# EAGLE design LickStick v1_0_1 (EAGLE 9.6.2)
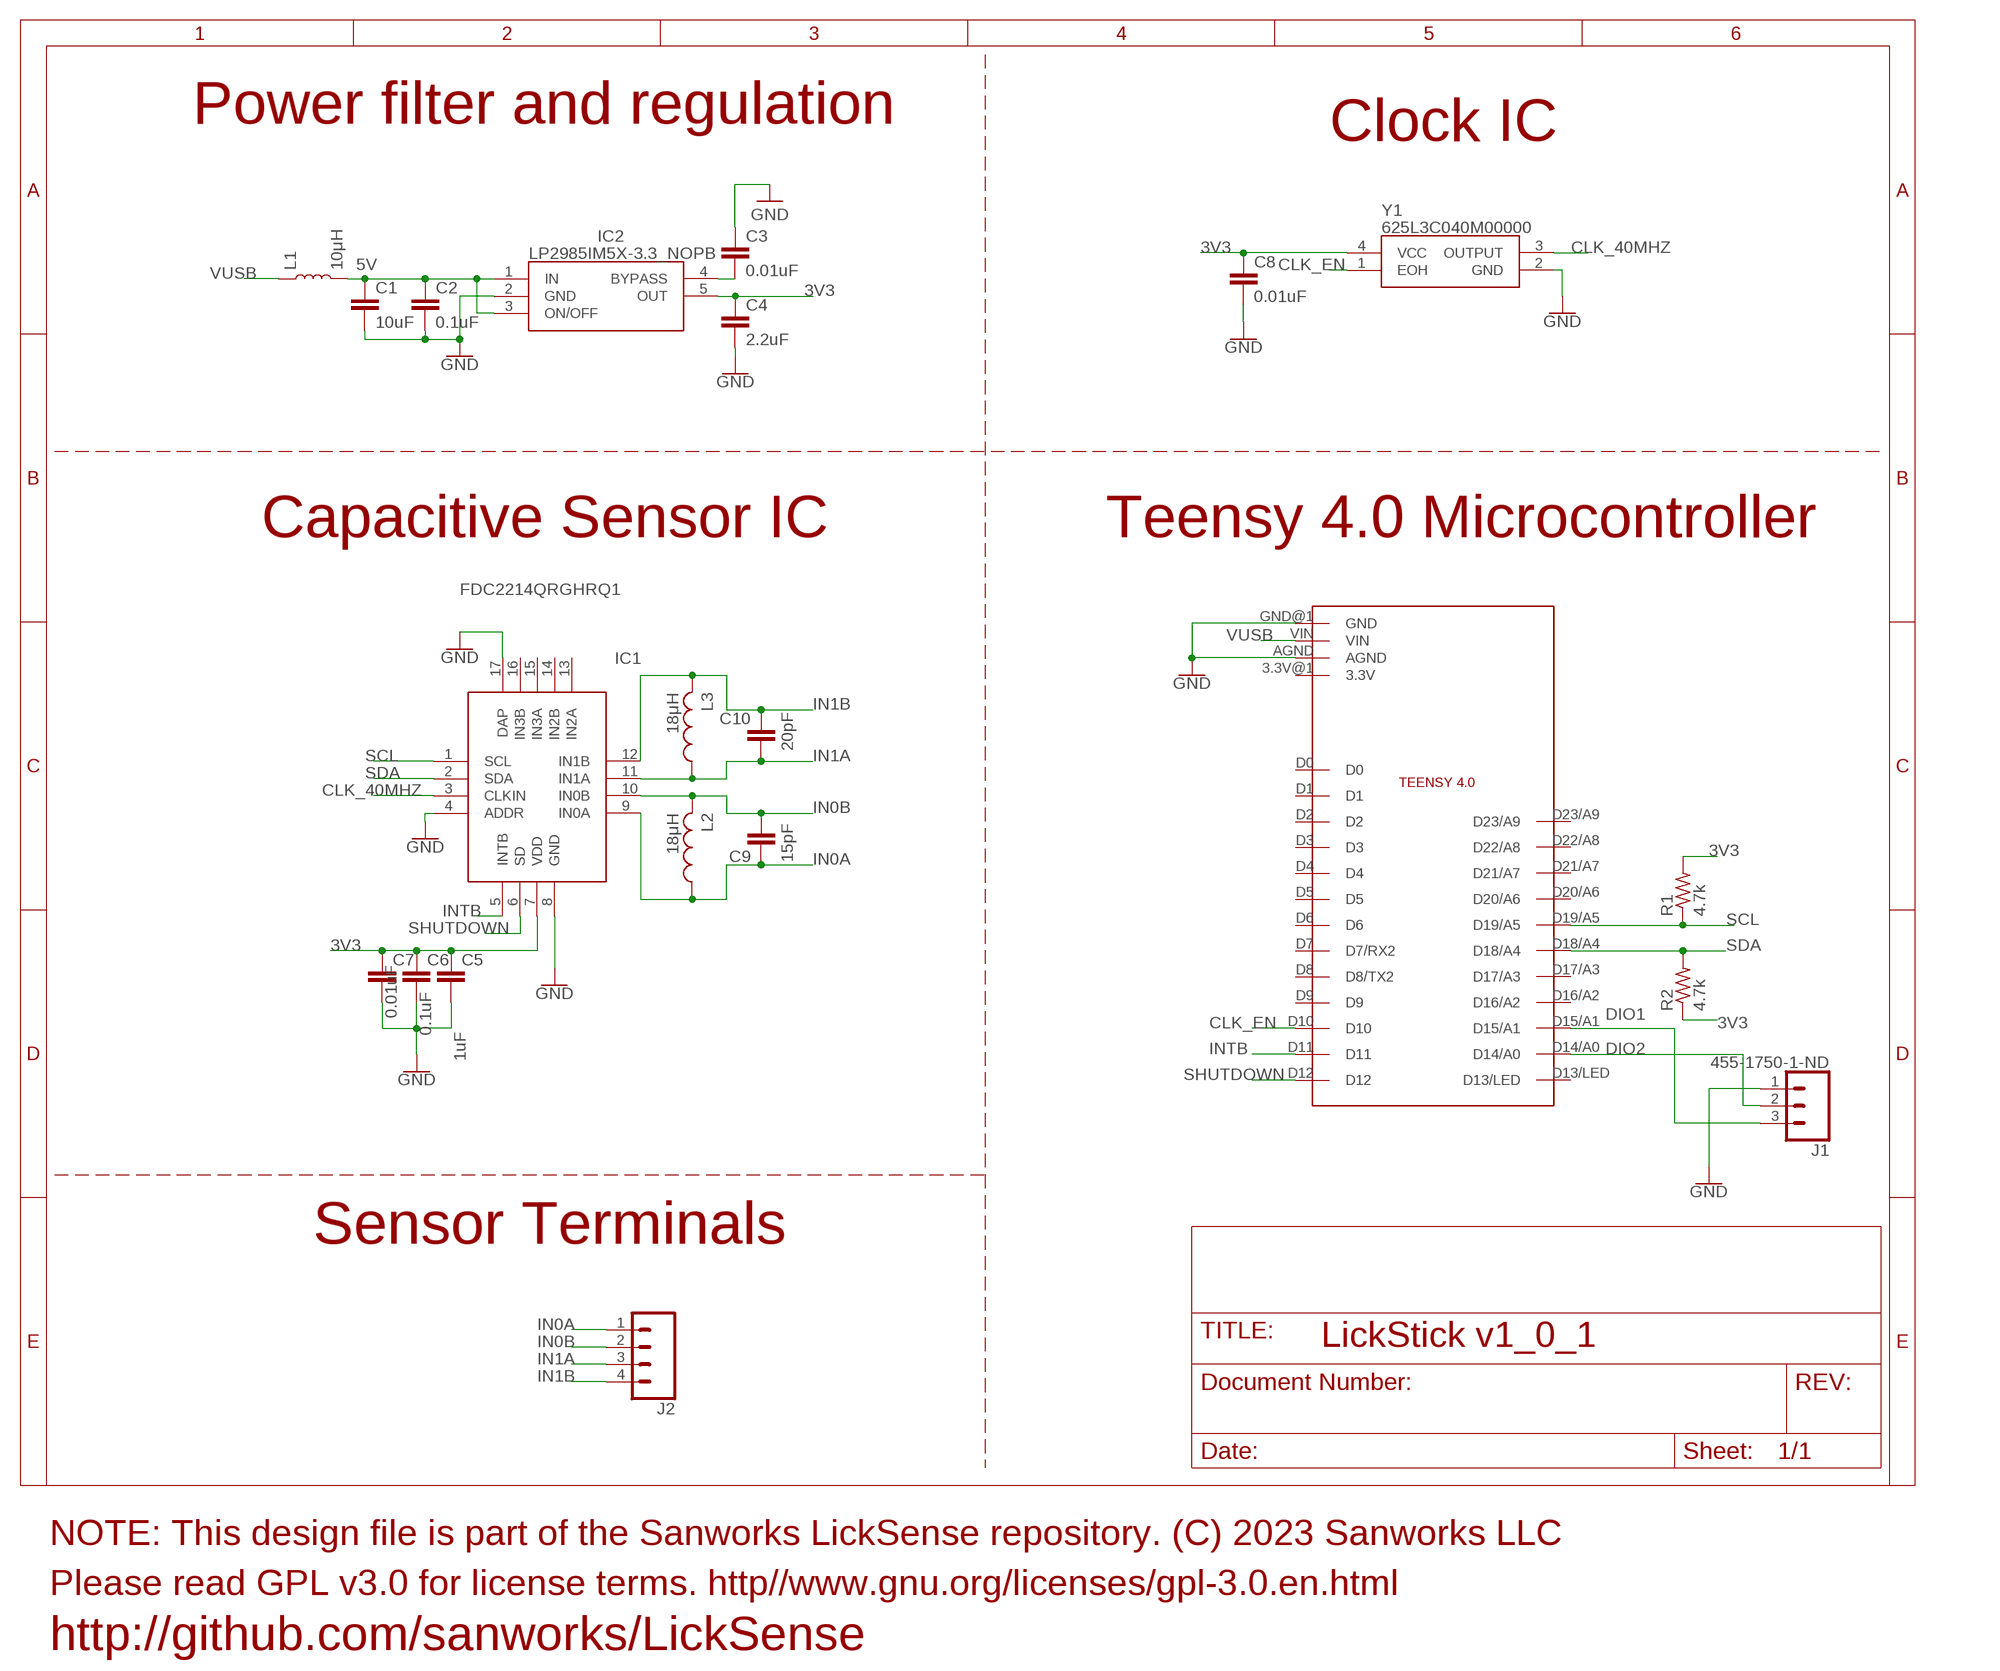
[diagram p0: schematic, sheet 1]

## Parts
C1  10uF  10UF-0805-10V-10%  [0805]
C2  0.1uF  1.0UF-0805-25V-(+80/-20%)  [0805]
C3  0.01uF  1.0UF-0805-25V-(+80/-20%)  [0805]
C4  2.2uF  1.0UF-0805-25V-(+80/-20%)  [0805]
C5  1uF  1.0UF-0805-25V-(+80/-20%)  [0805]
C6  0.1uF  1.0UF-0805-25V-(+80/-20%)  [0805]
C7  0.01uF  1.0UF-0805-25V-(+80/-20%)  [0805]
C8  0.01uF  1.0UF-0805-25V-(+80/-20%)  [0805]
C9  15pF  1.0UF-0805-25V-(+80/-20%)  [0805]
C10  20pF  1.0UF-0805-25V-(+80/-20%)  [0805]
IC1  FDC2214QRGHRQ1  [QFN50P400X400X80-17N]
IC2  LP2985IM5X-3.3_NOPB  [SOT95P280X145-5N]
J1  455-1750-1-ND  CONN_03  [1X03]
J2  CONN_04PTH  [1X04]
L1  10μH  2.2μH_SHIELDED_INDUCTOR  [0806]
L2  18μH  L-USL3225P  [L3225P]
L3  18μH  L-USL3225P  [L3225P]
MC1  TEENSY4.0_SIMPLE_NO_VUSB  [TEENSY4.0_SIMPLE_NO_VUSB]
R1  4.7k  R-US_R0805  [R0805]
R2  4.7k  R-US_R0805  [R0805]
Y1  625L3C040M00000  [625L3C040M00000]

## Nets
3V3: C4.1 C5.1 C6.1 C7.1 C8.1 IC1.7(VDD) IC2.5(OUT) R1.2 R2.1 Y1.4(VCC)
5V: C1.1 C2.1 IC2.1(IN) IC2.3(ON/OFF) L1.2
CLK_40MHZ: IC1.3(CLKIN) Y1.3(OUTPUT)
CLK_EN: MC1.D10 Y1.1(EOH)
DIO1: J1.3 MC1.D15/A1
DIO2: J1.2 MC1.D14/A0
GND: C1.2 C2.2 C3.1 C4.2 C5.2 C6.2 C7.2 C8.2 IC1.4(ADDR) IC1.8(GND) IC1.17(DAP) IC2.2(GND) J1.1 MC1.AGND MC1.GND@1(GND) Y1.2(GND)
IN0A: C9.1 IC1.9(IN0A) J2.1 L2.1
IN0B: C9.2 IC1.10(IN0B) J2.2 L2.2
IN1A: C10.1 IC1.11(IN1A) J2.3 L3.1
IN1B: C10.2 IC1.12(IN1B) J2.4 L3.2
INTB: IC1.5(INTB) MC1.D11
N$1: C3.2 IC2.4(BYPASS)
SCL: IC1.1(SCL) MC1.D19/A5 R1.1
SDA: IC1.2(SDA) MC1.D18/A4 R2.2
SHUTDOWN: IC1.6(SD) MC1.D12
VUSB: L1.1 MC1.VIN
Unconnected: IC1.13(IN2A) IC1.14(IN2B) IC1.15(IN3A) IC1.16(IN3B) MC1.3.3V@1(3.3V) MC1.D0 MC1.D1 MC1.D2 MC1.D3 MC1.D4 MC1.D5 MC1.D6 MC1.D7(D7/RX2) MC1.D8(D8/TX2) MC1.D9 MC1.D13/LED MC1.D16/A2 MC1.D17/A3 MC1.D20/A6 MC1.D21/A7 MC1.D22/A8 MC1.D23/A9

## Notes on the sheet
- Power filter and regulation
- Clock IC
- Capacitive Sensor IC | Teensy 4.0 Microcontroller
- Sensor Terminals
- NOTE: This design file is part of the Sanworks LickSense repository. (C) 2023 Sanworks LLC
- Please read GPL v3.0 for license terms. http//www.gnu.org/licenses/gpl-3.0.en.html
- http://github.com/sanworks/LickSense

## Library data of the parts
C1 = SparkFun-Capacitors:10UF: 10.0µF ceramic capacitors A capacitor is a passive two-terminal electrical component used to store electrical energy temporarily in an electric field.; PROD_ID: CAP-11330
C2-C10 = SparkFun-Capacitors:1.0UF: 1µF ceramic capacitors A capacitor is a passive two-terminal electrical component used to store electrical energy temporarily in an electric field.; PROD_ID: CAP-11625; VALUE: 1.0uF
IC1 = FDC2214QRGHRQ1:FDC2214QRGHRQ1: 4-channel, Noise-immune, AEC-Q100 qualified, 28-bit Capacitive Sensing Solution Source: Datasheet <http://www.ti.com/lit/gpn/fdc2214-q1>; DESCRIPTION: 4-channel, Noise-immune, AEC-Q100 qualified, 28-bit Capacitive Sensing Solution; HEIGHT: 0.8mm; MANUFACTURER_NAME: Texas Instruments; MANUFACTURER_PART_NUMBER: FDC2214QRGHRQ1; MOUSER_PART_NUMBER: 595-FDC2214QRGHRQ1; MOUSER_PRICE-STOCK: https://www.mouser.co.uk/ProductDetail/Texas-Instruments/FDC2214QRGHRQ1?qs=zEmsApcVOkXnIqI0octY2Q%3D%3D
IC2 = LP2985IM5X-3.3_NOPB:LP2985IM5X-3.3_NOPB: Low Dropout Regulators(LDO) positive Fixed 575mV @ 150mA 16V 3.3V 150mA SOT-23-5 RoHS Source: Datasheet <https://datasheet.lcsc.com/szlcsc/Texas-Instruments-TI-LP2985IM5X-3-3-NOPB_C129375.pdf>; DESCRIPTION: Low Dropout Regulators(LDO) positive Fixed 575mV @ 150mA 16V 3.3V 150mA SOT-23-5 RoHS; HEIGHT: 1.45mm; MANUFACTURER_NAME: Texas Instruments; MANUFACTURER_PART_NUMBER: LP2985IM5X-3.3/NOPB; MOUSER_PART_NUMBER: 926-LP2985IM5X33NOPB; MOUSER_PRICE-STOCK: https://www.mouser.co.uk/ProductDetail/Texas-Instruments/LP2985IM5X-33-NOPB?qs=7lkVKPoqpbarYOItF3geeg%3D%3D
J1 = SparkFun-Connectors:CONN_03: Multi connection point. Often used as Generic Header-pin footprint for 0.1 inch spaced/style header connections On any of the 0.1 inch spaced packages, you can populate with these: Break Away Headers - Straight <https://www.sparkfun.com/products/116> (PRT-00116) Break Away Male Headers - Right Angle <https://www.sparkfun.com/products/553> (PRT-00553) Female Headers <https://www.sparkfun.com/products/115> (PRT-00115) Break Away Headers - Machine Pin <https://www.sparkfun.com/products/117> (PRT-00117) Break Away Female Headers - Swiss Machine Pin <https://www.sparkfun.com/products/743> (PRT-00743) Stackable Header - 3 Pin (Female, 0.1") <https://www.sparkfun.com/products/13875> (PRT-13875) For SCREWTERMINALS and SPRING TERMINALS visit here: Screw Terimnals on SparkFun.com <https://www.sparkfun.com/search/results?term=Screw+Terminals> (5mm/3.5mm/2.54mm spacing) This device is also useful as a general connection point to wire up your design to another part of your project. Our various solder wires solder well into these plated through hole pads. Hook-Up Wire - Assortment (Stranded, 22 AWG) <https://www.sparkfun.com/products/11375> (PRT-11375) Hook-Up Wire - Assortment (Solid Core, 22 AWG) <https://www.sparkfun.com/products/11367> (PRT-11367) View the entire wire category on our website here <https://www.sparkfun.com/categories/141> Special notes: Molex polarized connector foot print use with SKU : PRT-08232 with associated crimp pins and housings.; PROD_ID: XXX-00000
J2 = SparkFun-Connectors:CONN_04: Multi connection point. Often used as Generic Header-pin footprint for 0.1 inch spaced/style header connections On any of the 0.1 inch spaced packages, you can populate with these: Break Away Headers - Straight <https://www.sparkfun.com/products/116> (PRT-00116) Break Away Male Headers - Right Angle <https://www.sparkfun.com/products/553> (PRT-00553) Female Headers <https://www.sparkfun.com/products/115> (PRT-00115) Break Away Headers - Machine Pin <https://www.sparkfun.com/products/117> (PRT-00117) Break Away Female Headers - Swiss Machine Pin <https://www.sparkfun.com/products/743> (PRT-00743) For SCREWTERMINALS and SPRING TERMINALS visit here: Screw Terimnals on SparkFun.com <https://www.sparkfun.com/search/results?term=Screw+Terminals> (5mm/3.5mm/2.54mm spacing) This device is also useful as a general connection point to wire up your design to another part of your project. Our various solder wires solder well into these plated through hole pads. Hook-Up Wire - Assortment (Stranded, 22 AWG) <https://www.sparkfun.com/products/11375> (PRT-11375) Hook-Up Wire - Assortment (Solid Core, 22 AWG) <https://www.sparkfun.com/products/11367> (PRT-11367) View the entire wire category on our website here <https://www.sparkfun.com/categories/141> Special notes: Molex polarized connector foot print use with SKU : PRT-08231 with associated crimp pins and housings. 1MM SMD Version SKU: PRT-10208; PROD_ID: CONN-09696
L1 = SparkFun-Coils:2.2μH_SHIELDED_INDUCTOR: Murata 2.2uH Inductor 2.2uH 1.2A 110mOhm 0806 Package Shielded Bourns 2.2uH Inductor 2.2uH 5.5A 205mOhm 5x5mm Package Shielded; PROD_ID: NDUC-14257
L2 L3 = rcl:L-US: INDUCTOR, American symbol; SPICEPREFIX: L
MC1 = Teensy4.0_SIMPLE_N_VUSB:TEENSY4.0_SIMPLE_NO_VUSB: Tennsy 4.0 simple layout (no underside pins or VUSB )
R1 R2 = adafruit:R-US_: RESISTOR, American symbol
Y1 = 625L3C040M00000:625L3C040M00000: Standard Clock Oscillators 40MHz 3.3V 50ppm Source: Datasheet <http://www.ctscorp.com/wp-content/uploads/625.pdf>; DESCRIPTION: Standard Clock Oscillators 40MHz 3.3V 50ppm; HEIGHT: 1mm; MANUFACTURER_NAME: CTS; MANUFACTURER_PART_NUMBER: 625L3C040M00000; MOUSER_PART_NUMBER: 774-625L3C040M00000; MOUSER_PRICE-STOCK: https://www.mouser.co.uk/ProductDetail/CTS-Electronic-Components/625L3C040M00000?qs=PDIOggHaj2zg4koWKiN8RQ%3D%3D

## Board
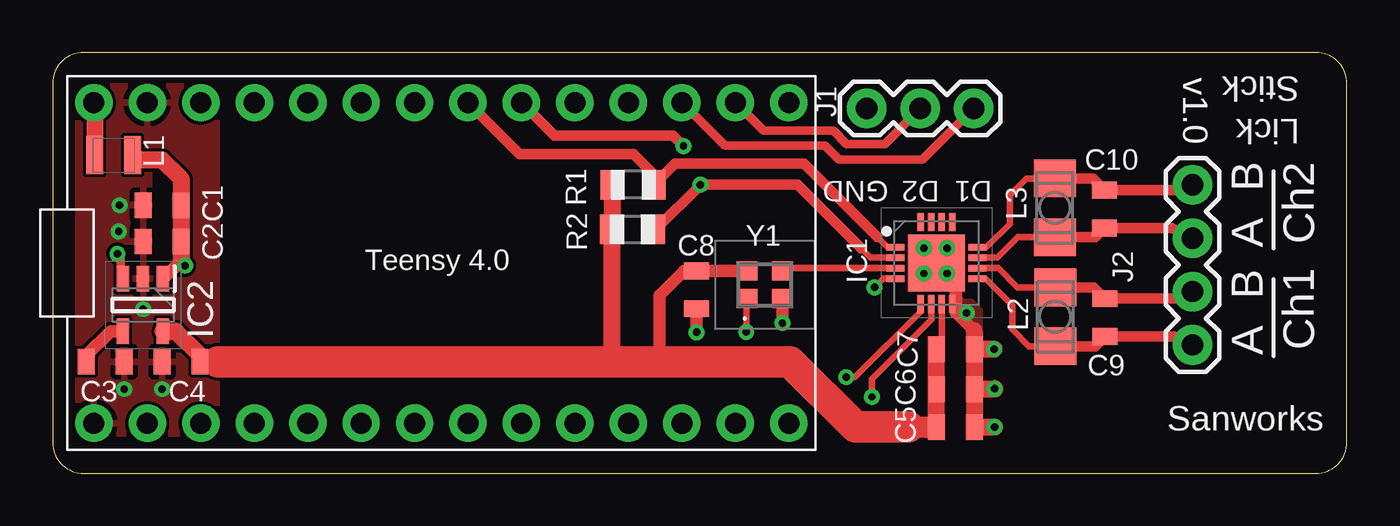
[diagram p1: board, top side]
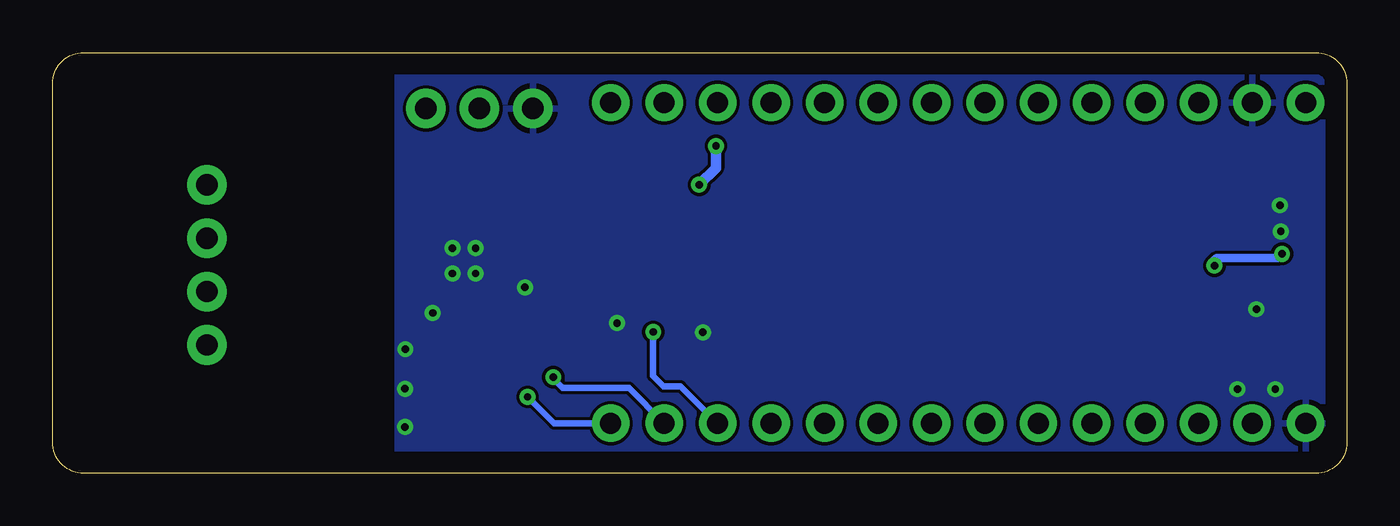
[diagram p2: board, bottom side, seen from below]

Size 61.5 x 20 mm. Coordinates in mm from the lower left corner, seen from the top.
Outline: 0,18.53 0,1.46 arc90 1.46,0 60.03,0 arc90 61.5,1.47 61.5,18.53 arc90 60.03,20 1.47,20 arc90 0,18.53
Copper layers (1*16): Top 0.035mm / dielectric 1.5mm / Bottom 0.035mm
Design rules "default": minimum track width 6mil, minimum drill 0.35mm, track to track 6mil, track to pad 6mil, pad to pad 6mil, via to via 6mil, smd to smd 6mil, copper to edge 40mil, drill to drill 6mil, minimum pad ring 10mil, minimum via ring 8mil, stop-mask expansion 4mil, vias tented up to drill 0mil, thermal gap 10mil
tRestrict: 1 lines

### Footprints (pad centres in the part's own frame; a part is rotated, then mirrored left to right if it is on the bottom)
0805 = smd 0.8 x 1.2: 1 -0.9,0; 2 0.9,0
QFN50P400X400X80-17N = smd 0.85 x 0.3: 1 -1.95,0.75; 2 -1.95,0.25; 3 -1.95,-0.25; 4 -1.95,-0.75; 9 1.95,-0.75; 10 1.95,-0.25; 11 1.95,0.25; 12 1.95,0.75 | smd 0.3 x 0.85: 5 -0.75,-1.95; 6 -0.25,-1.95; 7 0.25,-1.95; 8 0.75,-1.95; 13 0.75,1.95; 14 0.25,1.95; 15 -0.25,1.95; 16 -0.75,1.95 | smd 2.7 x 2.7: 17 0,0
SOT95P280X145-5N = smd 1.2 x 0.6: 1 -1.25,0.95; 2 -1.25,0; 3 -1.25,-0.95; 4 1.25,-0.95; 5 1.25,0.95
1X03 = drill 1.016 pad 1.88: 1 0,0; 2 2.54,0; 3 5.08,0
1X04 = drill 1.016 pad 1.88: 1 0,0; 2 2.54,0; 3 5.08,0; 4 7.62,0
0806 = smd 0.8 x 1.8: 1 -0.9,0; 2 0.9,0
L3225P = smd 1.8 x 2: 1 -1.4,0; 2 1.4,0
TEENSY4.0_SIMPLE_NO_VUSB = drill 1 pad 1.778: 3.3V@1 7.62,10.16; AGND 7.62,12.7; D0 -7.62,12.7; D1 -7.62,10.16; D2 -7.62,7.62; D3 -7.62,5.08; D4 -7.62,2.54; D5 -7.62,0; D6 -7.62,-2.54; D7 -7.62,-5.08; D8 -7.62,-7.62; D9 -7.62,-10.16; D10 -7.62,-12.7; D11 -7.62,-15.24; D12 -7.62,-17.78; D13/LED 7.62,-17.78; D14/A0 7.62,-15.24; D15/A1 7.62,-12.7; D16/A2 7.62,-10.16; D17/A3 7.62,-7.62; D18/A4 7.62,-5.08; D19/A5 7.62,-2.54; D20/A6 7.62,0; D21/A7 7.62,2.54; D22/A8 7.62,5.08; D23/A9 7.62,7.62; GND@1 -7.62,15.24; VIN 7.62,15.24
R0805 = smd 1.1 x 1.4: 1 -1,0; 2 1,0
625L3C040M00000 = smd 1 x 0.9: 1 -0.85,-0.65; 2 0.85,-0.65; 3 0.85,0.65; 4 -0.85,0.65

### Placement (x,y rotation side)
C1  5.2,12.74 180 top
C2  5.2,11.02 180 top
C3  2.5,5.3 180 top
C4  6.1,5.3 180 top
C5  42.9,2.2 0 top
C6  42.9,4 0 top
C7  42.9,5.9 0 top
C8  30.6,8.72 270 top
C9  50,7.4 90 top
C10  49.98,12.56 90 top
IC1  42,10 0 top
IC2  4.3,8 270 top
J1  38.68,17.34 0 top
J2  54.16,6.1 90 top
L1  2.9,15.12 0 top
L2  47.64,7.44 90 top
L3  47.62,12.62 90 top
MC1  17.2,10 90 top
R1  27.58,13.72 180 top
R2  27.56,11.6 0 top
Y1  33.84,8.96 0 top

### Tracks (layer width: path | path; a pad name or v marks a point on that pad's centre or on a via)
3V3
  Top 0.3: IC1.7 42.25,6.15 C7.1
  Top 0.6: 28.88,5.3 28.84,5.34 28.84,8.46 30,9.62 C8.1 Y1.4
  Top 0.8: IC2.5 5.85,6.75 7,5.6 C4.1 7.5,5.3 | C7.1 C6.1 C5.1 41.98,2.18 41.5,2.18 | R1.2 26.58,11.62 R2.1 26.56,5.3
  Top 1: 7.5,5.3 7.86,5.3 | 40.66,2.2 41.48,2.2 41.5,2.18
  Top 1.5: 7.86,5.3 26.56,5.3 28.88,5.3 35.04,5.3 38.14,2.2 40.66,2.2
5V  (via drill 0.35)
  Top 0.4: IC2.3 3.35,9.67 3.24,9.78 3.24,10.27 v3.08,10.43 | v6.29,9.87 6.29,9.91 6.1,10.1
  Top 0.6: L1.2 4.02,14.9 | 6.1,10.1 IC2.1
  Top 0.8: 4.02,14.9 5.2,14.9 6.1,14 C1.1 C2.1 6.1,10.1
  Bottom 0.4: v3.08,10.43 3.28,10.23 6.17,10.23 6.41,9.99 v6.29,9.87
CLK_40MHZ
  Top 0.3: IC1.3 34.83,9.75 Y1.3
CLK_EN  (via drill 0.35)
  Top 0.3: v32.96,6.72 32.96,8.28 Y1.1
  Bottom 0.3: MC1.D10 31.66,4.14 32.48,4.14 32.96,4.62 v32.96,6.72
DIO1
  Top 0.4: MC1.D15/A1 31.94,15.58 36.7,15.58 37.36,14.92 41.34,14.92 J1.3
DIO2
  Top 0.4: MC1.D14/A0 33.78,16.28 37.1,16.28 37.72,15.66 39.54,15.66 J1.2
GND  (via drill 0.35)
  Top 0.3: IC1.17 42,10.7 v42.5,10.7 | 42.95,7.62 42.95,7.85 IC1.8 42.92,7.88 42.92,7.62 | IC1.4 39.47,9.25 v39.06,8.84
  Top 0.6: 42.92,7.62 42.92,10.32 | 42.95,7.62 43.8,6.77 | C8.2 v30.6,6.7 | Y1.2 v34.69,7.15 v34.68,7.14
  Top 0.8: C7.2 v44.74,5.9 | C6.2 44.76,4 v44.76,4.02 | v44.76,2.2 C5.2 C7.2 | 43.8,6.77 C7.2
  other vias: 3.18,12.74 3.14,11.5 4.3,7.8 3.4,4 5.2,4 41.4,10.7 42.5,9.5 41.4,9.5 43.44,7.62
  pour Bottom: 45.1,19.7 2,19.7 arc90 0.3,18 0.3,1.75 arc90 1.65,0.4 45.1,0.4
  pour Top: 1,18.4 1,1.9 7.8,1.9 7.8,18.4
  pour Top: 44.16,6.88 44.16,7.78 43.7,8.24 43.22,8.24 43.22,8.68 43.06,8.52 43.06,7.78 43.96,6.88
IN0A
  Top 0.3: IC1.9 44.33,9.25 45.6,7.98 45.6,6.84 46.4,6.04 L2.1
  Top 0.4: 53.27,6.49 53.24,6.5
  Top 0.5: L2.1 49.54,6.04 C9.1 53.24,6.5 | 53.27,6.49 J2.1
IN0B
  Top 0.3: IC1.10 44.93,9.75 45.84,8.84 L2.2
  Top 0.5: L2.2 49.46,8.84 C9.2 53.32,8.3 J2.2
IN1A
  Top 0.3: IC1.11 44.89,10.25 45.86,11.22 L3.1
  Top 0.4: 53.18,11.66 53.17,11.66
  Top 0.5: L3.1 49.54,11.22 C10.1 53.17,11.66 | 53.18,11.66 J2.3
IN1B
  Top 0.3: IC1.12 44.37,10.75 45.48,11.86 45.48,13.22 46.28,14.02 L3.2
  Top 0.5: L3.2 49.42,14.02 C10.2 53.4,13.46 J2.4
INTB  (via drill 0.35)
  Top 0.3: v37.71,4.57 38.13,4.57 41.25,7.69 IC1.5
  Bottom 0.3: MC1.D11 34.12,4.06 37.28,4.06 37.75,4.53 v37.71,4.57
N$1
  Top 0.6: C3.2 1.6,5.6 2.75,6.75 IC2.4
SCL
  Top 0.3: R1.1 28.58,14.2 | IC1.1 39.67,10.75 39.2,11.22
  Top 0.5: 28.58,14.2 27.6,15.18 22.18,15.18 MC1.D19/A5 | 39.2,11.22 35.7,14.72 29.58,14.72 R1.1
SDA  (via drill 0.35)
  Top 0.3: IC1.2 38.87,10.25 38.44,10.68
  Top 0.5: 38.44,10.68 35.4,13.72 v30.78,13.72 30.78,13.7 28.68,11.6 R2.2 | MC1.D18/A4 23.84,16.06 29.48,16.06 v29.98,15.56
  Bottom 0.5: v29.98,15.56 29.98,14.52 v30.78,13.72
SHUTDOWN  (via drill 0.35)
  Top 0.3: v38.93,3.63 38.93,4.49 41.76,7.32 IC1.6
  Bottom 0.3: MC1.D12 37.68,2.38 v38.93,3.63
VUSB
  Top 0.8: MC1.VIN 2,17.58 L1.1

### Text on the board
tPlace: v1.0 | Stick | Lick | GND | D2 | D1 | B | A | Ch2 | Teensy 4.0 | B | A | Ch1 | Sanworks